# EAGLE design position-sensor-v1 (EAGLE 6.4)
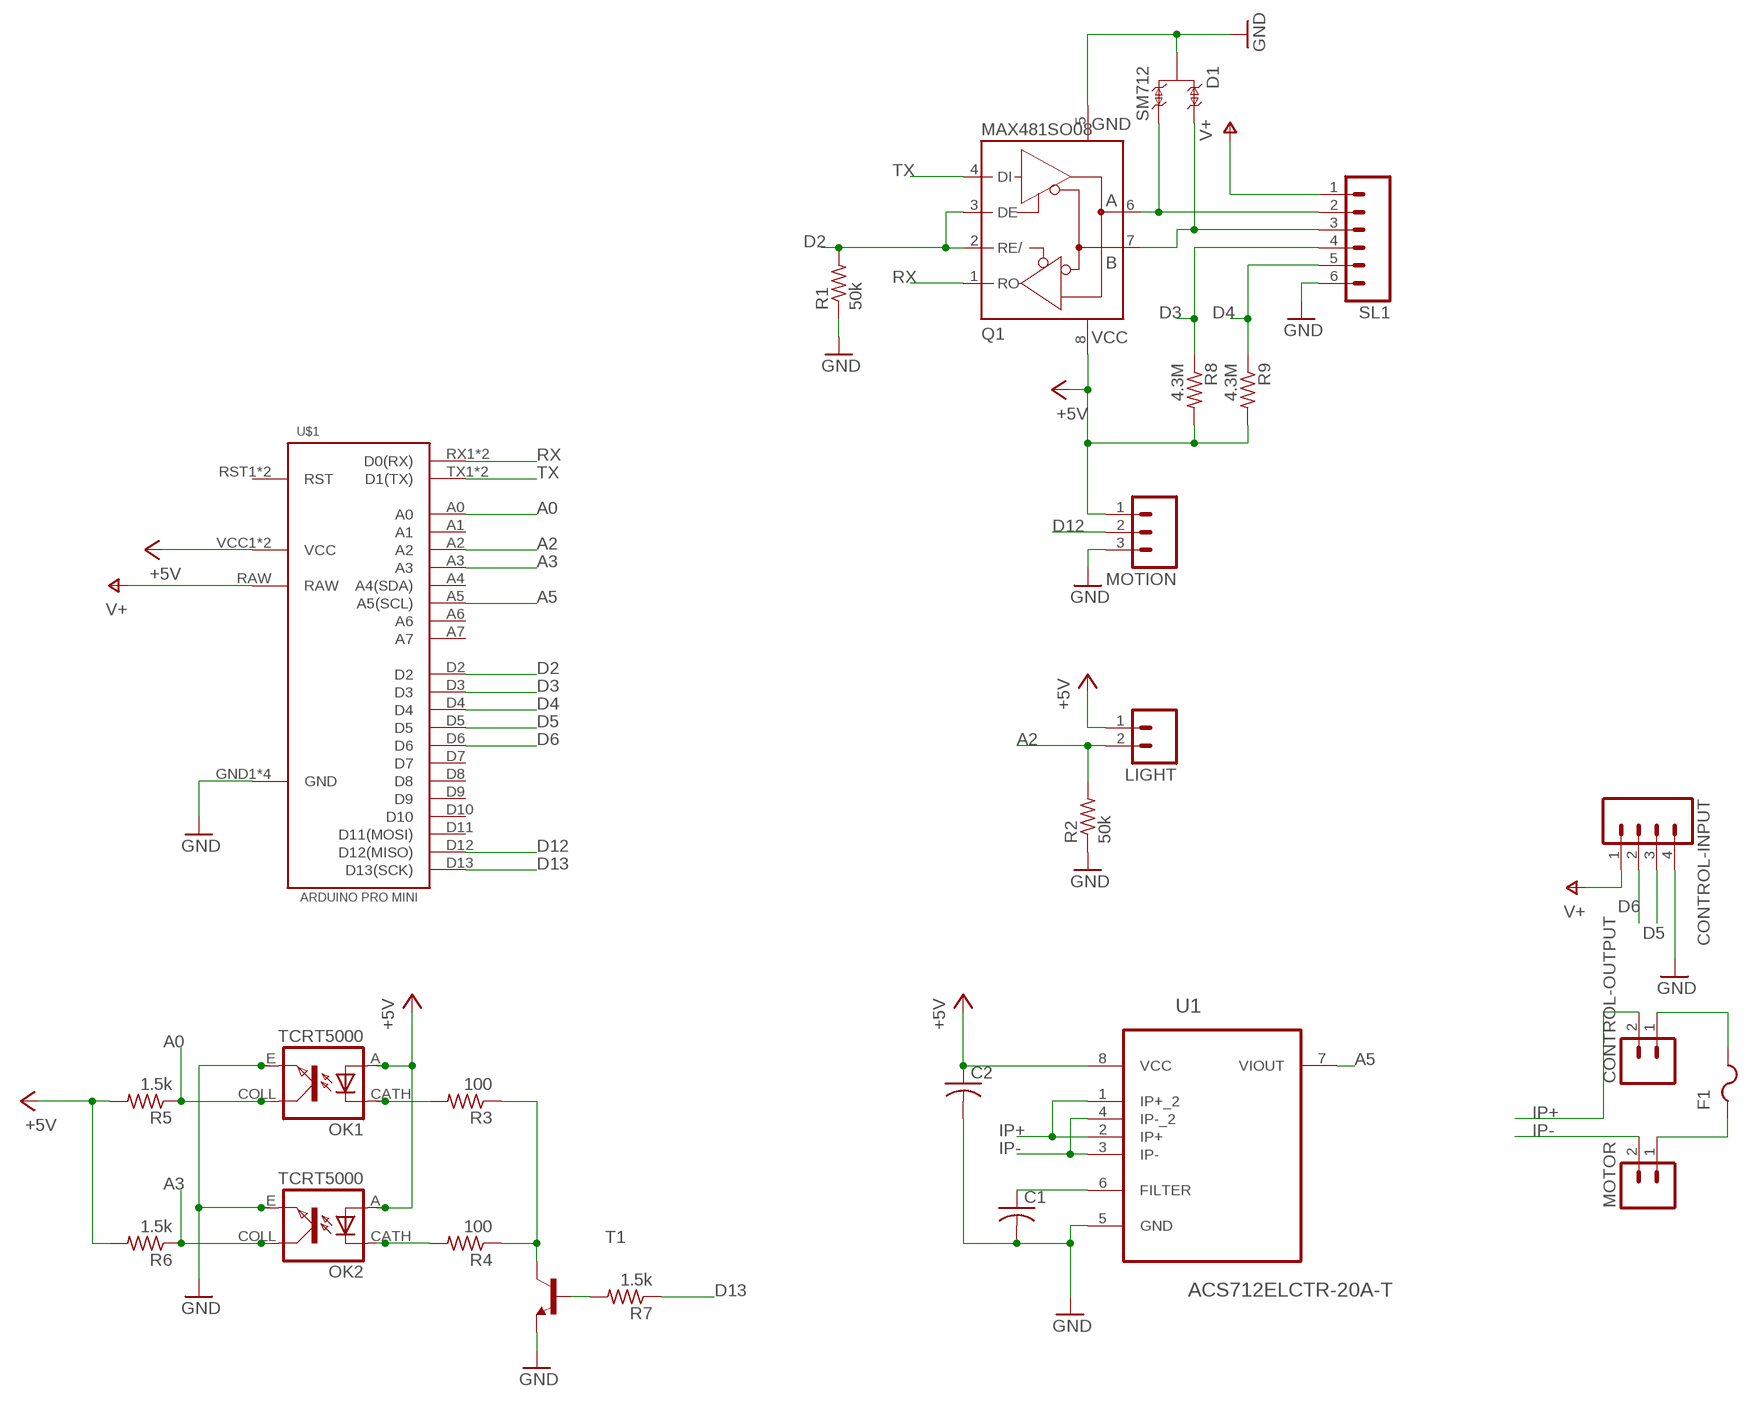
[diagram p0: schematic, sheet 1]

## Parts
C1  C-USC0603K  [C0603K]
C2  C-USC0603K  [C0603K]
CONTROL-INPUT  M04  [04P]
CONTROL-OUTPUT  M02  [02P]
D1  SM712  [SOT23-3]
F1  PTCFUSE-1812  [1812]
LIGHT  M02  [02P]
MOTION  M03  [03P]
MOTOR  M02  [02P]
OK1  TCRT5000  [TCRT5000]
OK2  TCRT5000  [TCRT5000]
Q1  MAX481SO08  [SO08]
R1  50k  R-US_R0603  [R0603]
R2  50k  R-US_R0603  [R0603]
R3  100  R-US_R0603  [R0603]
R4  100  R-US_R0603  [R0603]
R5  1.5k  R-US_R0603  [R0603]
R6  1.5k  R-US_R0603  [R0603]
R7  1.5k  R-US_R0603  [R0603]
R8  4.3M  R-US_R0603  [R0603]
R9  4.3M  R-US_R0603  [R0603]
SL1  M06  [06P]
T1  BC808-NPN-SOT23-BEC  [SOT23-BEC]
U1  ACS712ELCTR-20A-T  [SOIC127P600X175-8N]
U$1  ARDUINO-PRO-MINI  [ARDUINO-PRO-MINI]

## Nets
+5V: C2.1 LIGHT.1 MOTION.1 OK1.A OK2.A Q1.8(+5V) R5.2 R6.2 R8.2 R9.2 U1.8(VCC) U$1.VCC1(VCC) U$1.VCC2(VCC)
A0: OK1.COLL(COL) R5.1 U$1.A0
A2: LIGHT.2 R2.2 U$1.A2
A3: OK2.COLL(COL) R6.1 U$1.A3
A5: U1.7(VIOUT) U$1.A5(A5(SCL))
D2: Q1.2(RE/) Q1.3(DE) R1.2 U$1.D2
D3: R8.1 SL1.4 U$1.D3
D4: R9.1 SL1.5 U$1.D4
D5: CONTROL-INPUT.3 U$1.D5
D6: CONTROL-INPUT.2 U$1.D6
D12: MOTION.2 U$1.D12(D12(MISO))
D13: R7.1 U$1.D13(D13(SCK))
GND: C1.2 C2.2 CONTROL-INPUT.4 D1.3 MOTION.3 OK1.E(EMI) OK2.E(EMI) Q1.5(GND) R1.1 R2.1 SL1.6 T1.E U1.5(GND) U$1.GND1(GND) U$1.GND2(GND) U$1.GND3(GND) U$1.GND4(GND)
IP+: CONTROL-OUTPUT.2 U1.1(IP+_2) U1.2(IP+)
IP-: MOTOR.2 U1.3(IP-) U1.4(IP-_2)
N$1: D1.1 Q1.6(A) SL1.2
N$2: D1.2 Q1.7(B) SL1.3
N$3: F1.1 MOTOR.1
N$4: OK1.CATH(C) R3.2
N$5: OK2.CATH(C) R4.2
N$6: CONTROL-OUTPUT.1 F1.2
N$7: R7.2 T1.B
N$8: R3.1 R4.1 T1.C
N$13: C1.1 U1.6(FILTER)
RX: Q1.1(RO) U$1.RX1(D0(RX)) U$1.RX2(D0(RX))
TX: Q1.4(DI) U$1.TX1(D1(TX)) U$1.TX2(D1(TX))
V+: CONTROL-INPUT.1 SL1.1 U$1.RAW
Unconnected: U$1.A1 U$1.A4(A4(SDA)) U$1.A6 U$1.A7 U$1.D7 U$1.D8 U$1.D9 U$1.D10 U$1.D11(D11(MOSI)) U$1.RST1(RST) U$1.RST2(RST)

## Library data of the parts
C1 C2 = adafruit:C-US: CAPACITOR, American symbol
CONTROL-INPUT = con-amp-quick:M04: AMP QUICK CONNECTOR; OC_FARNELL: unknown; OC_NEWARK: unknown
CONTROL-OUTPUT LIGHT MOTOR = con-amp-quick:M02: AMP QUICK CONNECTOR; OC_FARNELL: unknown; OC_NEWARK: unknown
D1 = serge:SM712: SM712 Series 600W Asymmetrical TVS Diode Array; Datasheet: http://www.littelfuse.com/~/media/electronics/datasheets/tvs_diode_arrays/littelfuse_tvs_diode_array_sm712_datasheet.pdf.pdf
F1 = adafruit:PTCFUSE: PTC fuses, resettable thermistors
MOTION = con-amp-quick:M03: AMP QUICK CONNECTOR; OC_FARNELL: unknown; OC_NEWARK: unknown
OK1 OK2 = serge:TCRT5000
Q1 = serge:MAX481
R1-R9 = adafruit:R-US_: RESISTOR, American symbol
SL1 = con-amp-quick:M06: AMP QUICK CONNECTOR; OC_FARNELL: unknown; OC_NEWARK: unknown
T1 = transistor:*-NPN-: NPN Transistror BF959 corrected 2008.03.06
U1 = Allegro_By_element14_Batch_1:ACS712ELCTR-20A-T: Linear Current Sensor; MPN: ACS712ELCTR-20A-T; OC_FARNELL: 1329624; OC_NEWARK: 31M3133; PACKAGE: SOIC-8; SUPPLIER: Allegro
U$1 = serge:ARDUINO-PRO-MINI

## Board
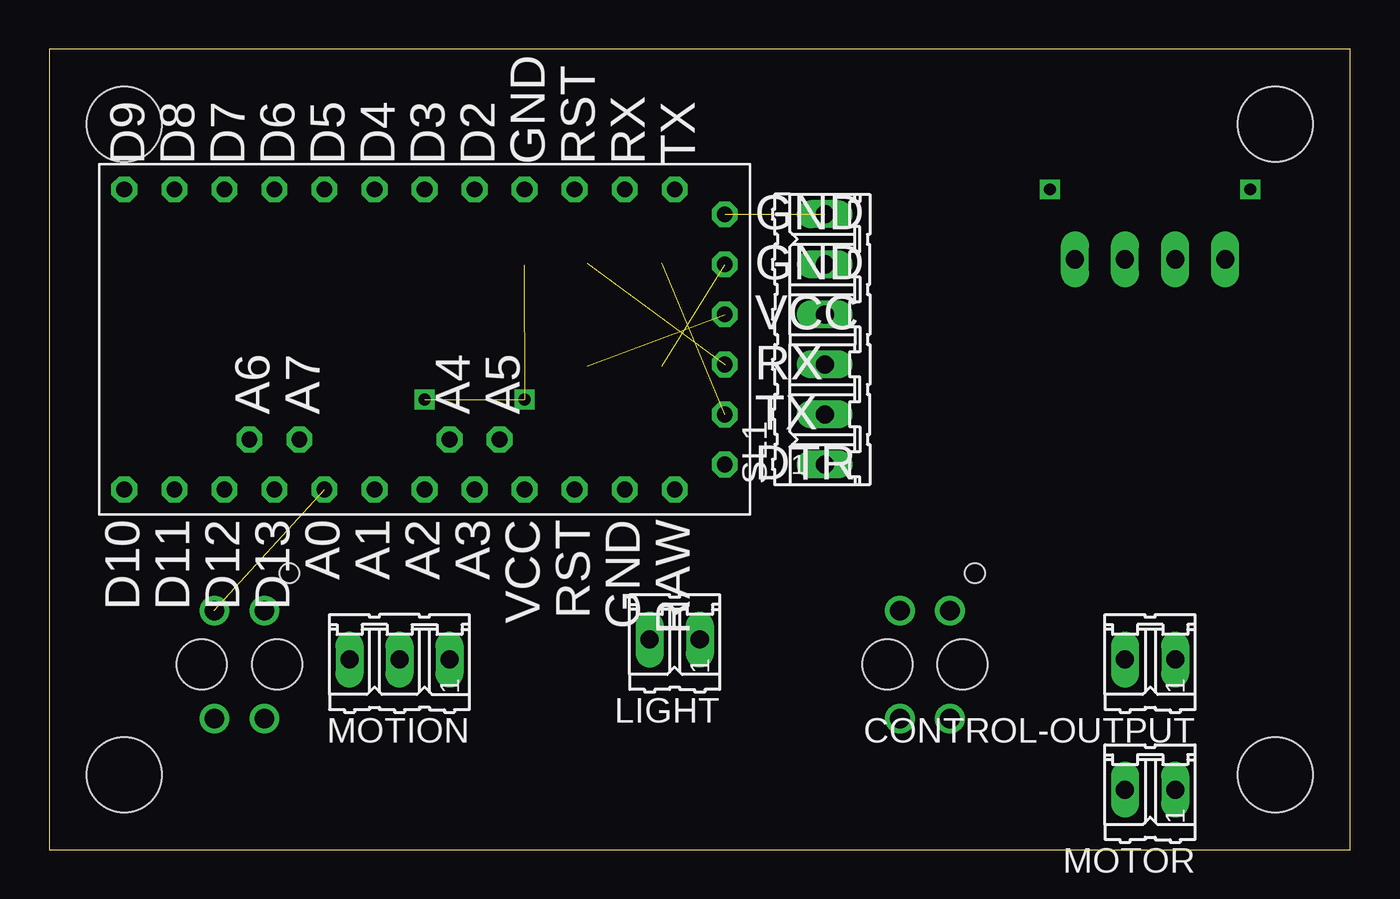
[diagram p1: board, top side]
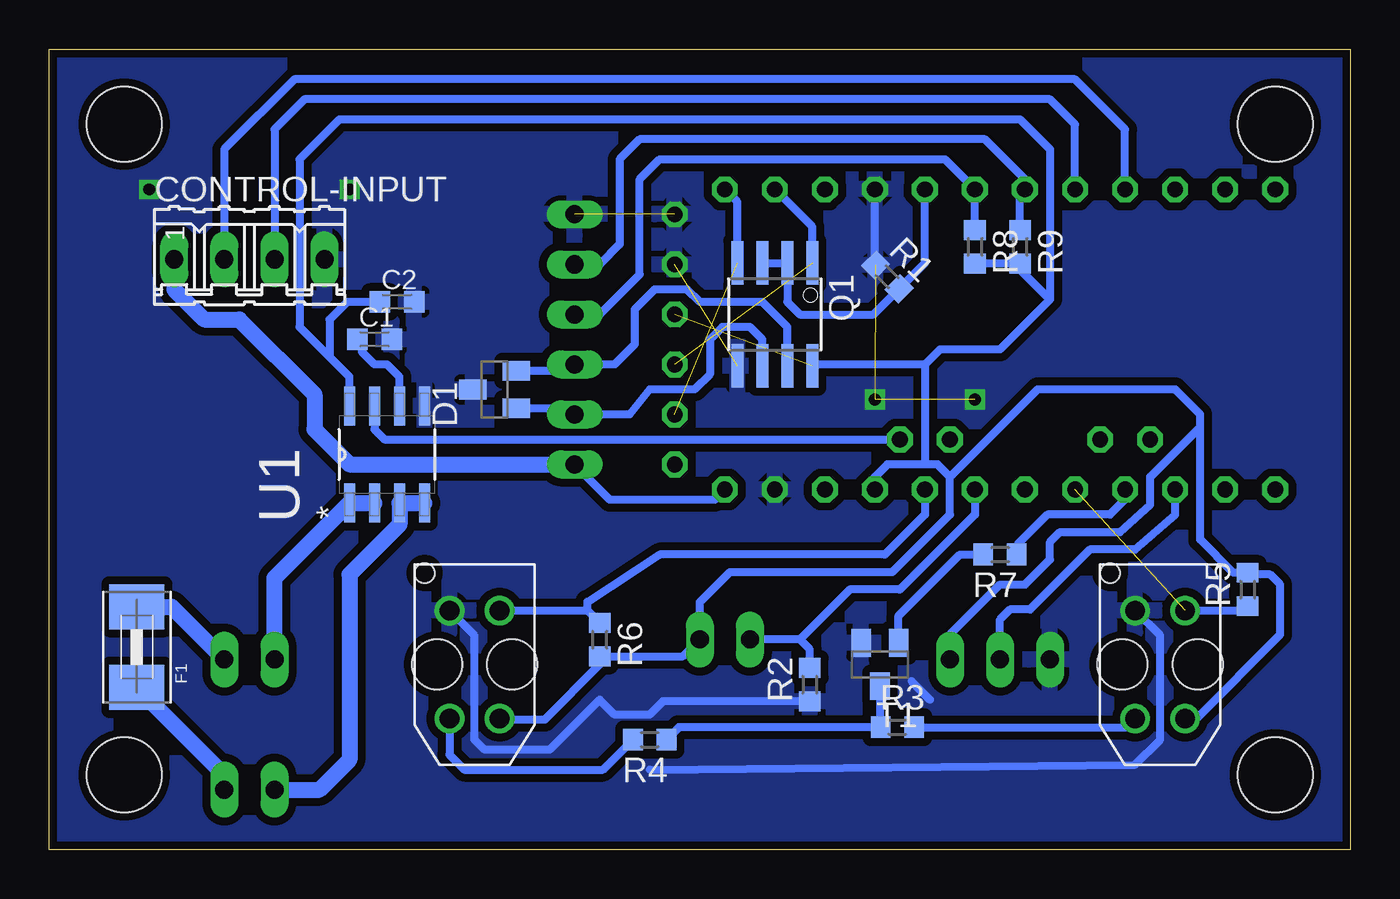
[diagram p2: board, bottom side, seen from below]

Size 66.04 x 40.64 mm. Coordinates in mm from the lower left corner, seen from the top.
Outline: 0,0 66.04,0 66.04,40.64 0,40.64 0,0
Copper layers (1*16): Top 0.035mm / dielectric 1.5mm / Bottom 0.035mm
Design rules "default": minimum track width 10mil, minimum drill 24mil, track to track 16mil, track to pad 16mil, pad to pad 16mil, via to via 16mil, smd to smd 16mil, copper to edge 16mil, drill to drill 8mil, minimum pad ring 10mil, minimum via ring 8mil, stop-mask expansion 4mil, vias tented up to drill 0mil, thermal gap 10mil
Holes 3.81 mm at 3.81,3.81 3.81,36.83 62.23,36.83 62.23,3.81

### Footprints (pad centres in the part's own frame; a part is rotated, then mirrored left to right if it is on the bottom)
C0603K = smd 1.05 x 1.08: 1 -0.875,0; 2 0.875,0
04P = drill 0.914 long: 1 -3.81,0; 2 -1.27,0; 3 1.27,0; 4 3.81,0
02P = drill 0.914 long: 1 -1.27,0; 2 1.27,0
SOT23-3 = smd 1 x 1.4: 1 -0.95,-1.1; 2 0.95,-1.1; 3 0,1.1
1812 = smd 2.286 x 2.794: 1 -2.046,0; 2 2.046,0
03P = drill 0.914 long: 1 -2.54,0; 2 0,0; 3 2.54,0
TCRT5000 = drill 1: A 2.743,1.27; CATH 2.743,-1.27; COLL -2.743,1.27; E -2.743,-1.27 | hole 2.54: 0,1.905; 0,-1.905 | hole 1: -4.648,-2.54
SO08 = smd 0.61 x 2.21: 1 -1.905,-2.616; 2 -0.635,-2.616; 3 0.635,-2.616; 4 1.905,-2.616; 5 1.905,2.616; 6 0.635,2.616; 7 -0.635,2.616; 8 -1.905,2.616
R0603 = smd 1 x 1.1: 1 -0.85,0; 2 0.85,0
06P = drill 0.914 long: 1 -6.35,0; 2 -3.81,0; 3 -1.27,0; 4 1.27,0; 5 3.81,0; 6 6.35,0
SOT23-BEC = smd 1 x 1.4: B -0.95,-1.1; C 0,1.1; E 0.95,-1.1
SOIC127P600X175-8N = smd 1.981 x 0.559: 1 -2.464,1.905; 2 -2.464,0.635; 3 -2.464,-0.635; 4 -2.464,-1.905; 5 2.464,-1.905; 6 2.464,-0.635; 7 2.464,0.635; 8 2.464,1.905
ARDUINO-PRO-MINI = drill 0.8 octagon: A0 -3.81,-7.62; A1 -1.27,-7.62; A2 1.27,-7.62; A3 3.81,-7.62; A4 2.54,-5.08; A5 5.08,-5.08; A6 -7.62,-5.08; A7 -5.08,-5.08; D2 3.81,7.62; D3 1.27,7.62; D4 -1.27,7.62; D5 -3.81,7.62; D6 -6.35,7.62; D7 -8.89,7.62; D8 -11.43,7.62; D9 -13.97,7.62; D10 -13.97,-7.62; D11 -11.43,-7.62; D12 -8.89,-7.62; D13 -6.35,-7.62; DTR 16.51,-6.35; GND1 11.43,-7.62; GND2 16.51,6.35; GND3 16.51,3.81; GND4 6.35,7.62; RAW 13.97,-7.62; RST1 8.89,7.62; RST2 8.89,-7.62; RX1 11.43,7.62; RX2 16.51,-1.27; TX1 13.97,7.62; TX2 16.51,-3.81; VCC1 16.51,1.27; VCC2 6.35,-7.62

### Placement (x,y rotation side)
C1  49.53,25.91 0 bottom
C2  48.39,27.81 0 bottom
CONTROL-INPUT  55.88,29.97 0 bottom
CONTROL-OUTPUT  55.88,9.65 180 top
D1  43.43,23.37 90 bottom
F1  61.59,10.29 90 bottom
LIGHT  31.75,10.67 180 top
MOTION  17.78,9.65 180 top
MOTOR  55.88,3.05 180 top
OK1  9.65,9.4 270 bottom
OK2  44.45,9.4 270 bottom
Q1  29.21,27.18 180 bottom
R1  23.5,29.08 315 bottom
R2  27.43,8.38 90 bottom
R3  22.99,6.22 0 bottom
R4  35.56,5.59 180 bottom
R5  5.21,13.21 90 bottom
R6  38.1,10.67 270 bottom
R7  17.78,14.99 180 bottom
R8  19.05,30.61 270 bottom
R9  16.76,30.61 270 bottom
SL1  39.37,25.91 90 top
T1  23.88,9.4 180 bottom
U1  48.9,20.07 90 bottom
U$1  17.78,25.91 0 top

### Tracks (layer width: path | path; a pad name or v marks a point on that pad's centre or on a via)
+5V  (1 unrouted)
  Bottom 0.406: 27.3,24 Q1.8 27.23,24.64 21.59,24.64 | U$1.VCC2 24.13,18.92 23.5,19.56 21.59,19.56 | U1.8 50.8,24 51.82,25.02 | 20.32,18.92 20.95,19.56 21.59,19.56 | 7.62,21.46 7.62,15.75 5.93,14.06 R5.2 5.12,13.97 4.06,13.97 3.56,13.46 3.56,10.92 7.82,6.66 OK1.A | 7.62,21.46 7.62,22.1 8.89,23.37 15.88,23.37 20.32,18.92 | OK2.A 43.13,6.6 40.89,6.6 38.1,9.4 R6.2 33.87,9.82 LIGHT.1 33.02,12.57 31.5,14.1 23.24,14.1 20.32,17.02 20.32,18.92 | 15.24,27.94 15.24,35.56 16.76,37.08 51.31,37.08 53.34,35.05 53.34,26.54 51.82,25.02 | 21.59,24.64 21.59,19.56 | C2.1 50.93,27.81 51.82,26.92 51.82,25.02 | MOTION.1 20.32,10.92 17.78,13.46 16.51,13.46 15.24,14.73 15.24,15.62 14.73,16.13 11.68,16.13 10.16,17.53 10.16,18.92 7.62,21.46 | 15.24,27.94 17.78,25.4 20.83,25.4 21.59,24.64 | 15.24,27.94 16.76,29.46 R9.2 R8.2
A0  (1 unrouted)
  Bottom 0.406: OK1.COLL 5.42,12.14 R5.1
A2
  Bottom 0.406: 27.94,10.67 LIGHT.2 | U$1.A2 19.05,17.02 22.86,13.21 25.4,13.21 27.94,10.67 | R2.2 27.43,10.16 27.94,10.67
A3
  Bottom 0.406: OK2.COLL 38.72,12.14 | 38.72,12.14 R6.1 | 38.72,12.14 38.72,12.59 35.05,14.99 23.62,14.99 21.59,17.02 U$1.A3
A5
  Bottom 0.406: U1.7 49.53,21.34 49.02,20.83 U$1.A5
D2
  Bottom 0.406: Q1.3 Q1.2 28.57,27.81 27.94,27.18 24.2,27.18 R1.2 21.59,29.79 U$1.D2
D3
  Bottom 0.406: SL1.4 38.1,27.18 36.07,29.21 36.07,34.04 35.05,35.05 20.57,35.05 U$1.D3 R8.1
D4
  Bottom 0.406: SL1.5 38.1,29.72 37.08,30.73 37.08,35.05 36.07,36.07 18.54,36.07 16.51,34.04 U$1.D4 16.76,33.27 R9.1
D5
  Bottom 0.406: U$1.D5 13.97,36.83 15.24,38.1 53.09,38.1 54.61,36.58 CONTROL-INPUT.3
D6
  Bottom 0.406: U$1.D6 11.43,36.58 13.97,39.12 53.59,39.12 57.15,35.56 CONTROL-INPUT.2
D12
  Bottom 0.406: MOTION.2 17.78,11.68 17.27,12.19 16.26,12.19 13.21,15.24 10.92,15.24 8.89,17.02 U$1.D12
D13
  Bottom 0.406: U$1.D13 11.43,17.78 12.19,17.02 15.37,17.02 16.89,15.49 16.89,15.03 R7.1
GND  (via drill 0.6)  (4 unrouted)
  Bottom 0.406: R1.1 24.13,29.72 U$1.GND4 | 22.27,8.55 21.34,7.62 | R2.1 34.89,7.53 35.56,6.86 37.34,6.86 38.1,7.62 40.64,5.08 43.94,5.08 44.45,5.59 44.45,10.87 OK2.E | 35.56,4.06 10.92,4.32 9.65,5.59 9.65,10.87 OK1.E
  other vias: 19.05,22.86 24.13,22.86 50.8,33.53 60.96,33.53
  pour Bottom: 0,48.26 0,0 99.06,0 99.06,48.26
IP+
  Bottom 0.813: U1.2 U1.1 54.61,13.79 CONTROL-OUTPUT.2
IP-
  Bottom 0.813: U1.4 U1.3 48.26,16.51 50.8,13.97 50.8,4.57 52.32,3.05 MOTOR.2
N$1
  Bottom 0.406: Q1.6 29.84,25.91 30.48,26.54 31.88,26.54 32.51,25.91 32.51,24.13 33.27,23.37 35.56,23.37 36.58,22.1 SL1.2 39.69,22.42 D1.1
N$2
  Bottom 0.406: Q1.7 28.57,26.54 29.84,27.81 33.02,27.81 33.66,28.45 35.31,28.45 36.32,27.43 36.32,25.65 37.34,24.64 SL1.3 | 39.12,24.64 SL1.3 | D1.2 39.69,24.32 SL1.3
N$3
  Bottom 0.813: MOTOR.1 57.15,3.8 F1.1
N$4
  Bottom 0.406: R3.2 11.35,6.22 OK1.CATH
N$5
  Bottom 0.406: OK2.CATH 45.72,4.83 44.96,4.06 37.93,4.06 R4.2
N$6
  Bottom 0.813: F1.2 59.83,12.33 CONTROL-OUTPUT.1
N$7
  Bottom 0.406: R7.2 19.81,14.99 22.93,11.87 T1.B
N$8
  Bottom 0.406: 23.62,6.44 R3.1 | R3.1 34.08,6.22 R4.1 | T1.C 23.88,6.26 R3.1
N$13
  Bottom 0.406: U1.6 48.26,24 48.9,24.64 49.53,24.64 50.16,25.27 50.16,25.67 C1.1
RX  (1 unrouted)
  Bottom 0.406: Q1.1 27.3,31.62 U$1.RX1
TX  (1 unrouted)
  Bottom 0.406: Q1.4 31.11,32.89 U$1.TX1
V+
  Bottom 0.406: SL1.1 37.59,17.78 32.26,17.78 U$1.RAW
  Bottom 0.813: CONTROL-INPUT.1 59.69,28.45 58.17,26.92 56.39,26.92 52.58,23.11 52.58,21.34 50.8,19.56 SL1.1